# Altium schematic sheet LTC2949.SchDoc: LTC2949
size A4; Author: Andrea P; Organization: Waterloop; Address1: 200 University Ave W; Address2: Engineering 5, 1104; Address3: Waterloo, ON; Address4: N2L 3G1; Revision: B; SheetNumber: 2; SheetTotal: 4
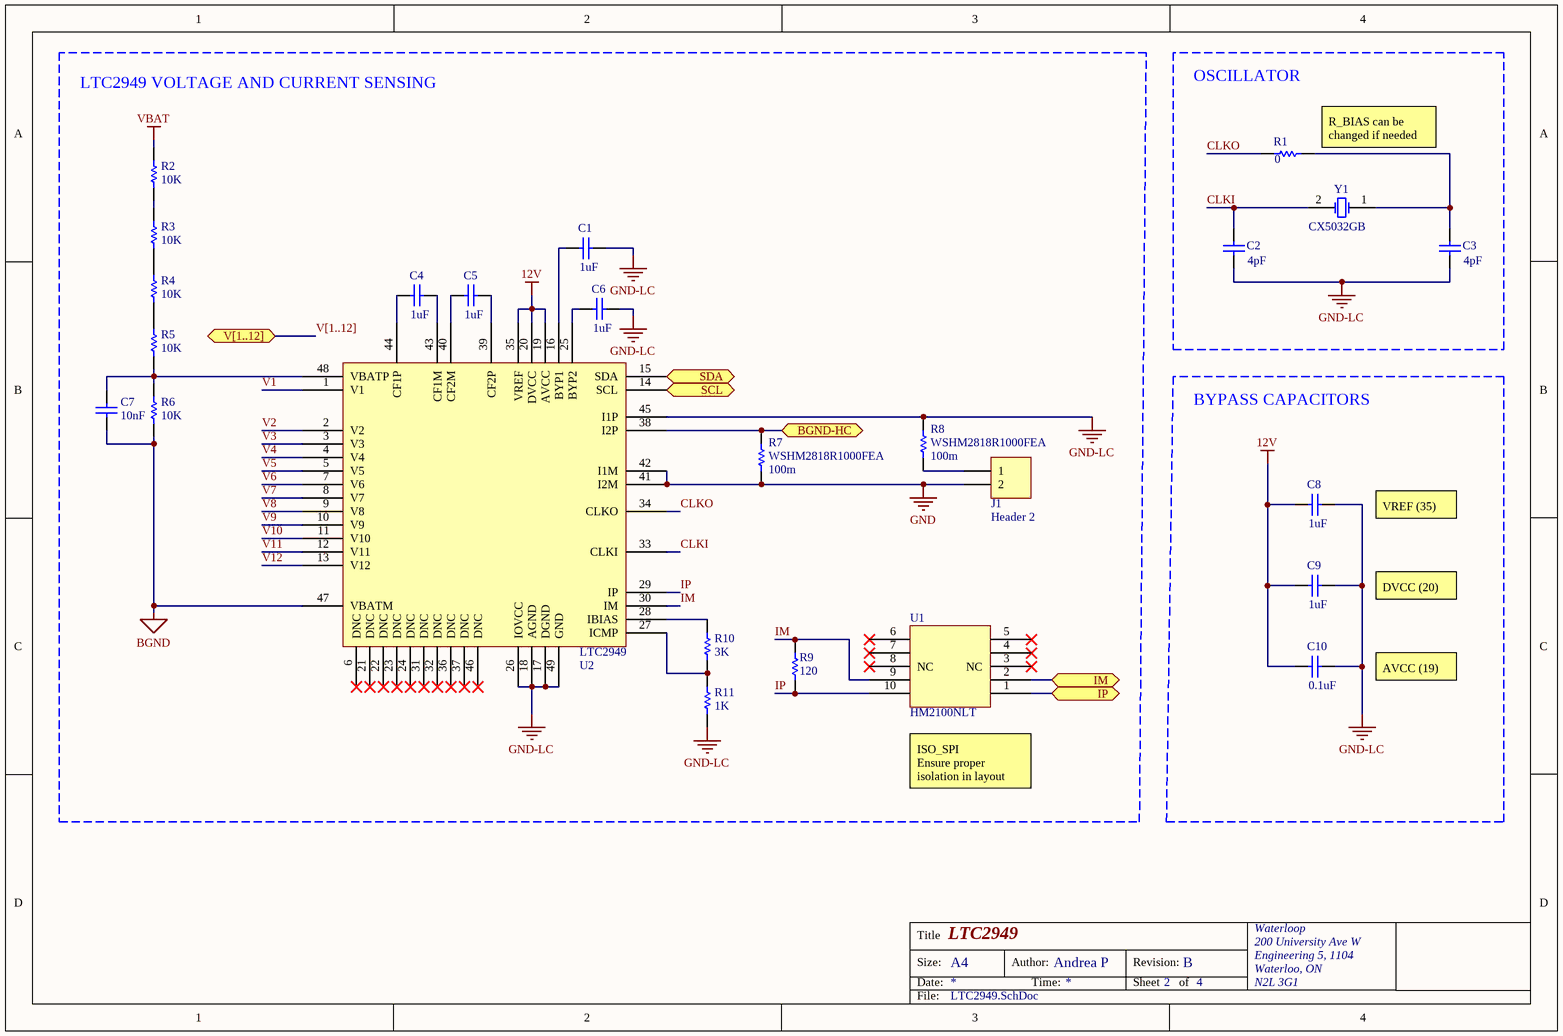
[diagram p0: LTC2949.SchDoc]

## Parts
C1  value 1uF  [C0805]  (hidden comment: Cap)
C2  value 4pF  [C0805]  (hidden comment: 50V)
C3  value 4pF  [C0805]  (hidden comment: 50V)
C4  value 1uF  [C0805]  (hidden comment: Cap)
C5  value 1uF  [C0805]  (hidden comment: Cap)
C6  value 1uF  [C0805]  (hidden comment: Cap)
C7  value 10nF  [C0805]  (hidden comment: Cap)
C8  value 1uF  [C0805]  (hidden comment: Cap)
C9  value 1uF  [C0805]  (hidden comment: Cap)
C10  value 0.1uF  [C0805]  (hidden comment: Cap)
J1  Header 2  [HDR1X2]
R1  value 0  [J1-0603]  (hidden comment: 0603)
R2  value 10K  [J1-0603]  (hidden comment: Res1)
R3  value 10K  [J1-0603]  (hidden comment: Res1)
R4  value 10K  [J1-0603]  (hidden comment: Res1)
R5  value 10K  [J1-0603]  (hidden comment: Res1)
R6  value 10K  [J1-0603]  (hidden comment: Res1)
R7  value 100m  Part Number: WSHM2818R1000FEA  [2818]  (hidden comment: Res1)
R8  value 100m  Part Number: WSHM2818R1000FEA  [2818]  (hidden comment: Res1)
R9  value 120  [J1-0603]  (hidden comment: 1%)
R10  value 3K  [J1-0603]  (hidden comment: 1%)
R11  value 1K  [J1-0603]  (hidden comment: 1%)
U1  HM2100NLT  [HM2100NLT]
U2  LTC2949  [LTC2949]
Y1  CX5032GB  [CX5032GB08000H0HPQZ1]

## Blocks framed on the sheet
LTC2949 VOLTAGE AND CURRENT SENSING: C1 C4-C7 J1 R2-R11 U1 U2
OSCILLATOR: C2 C3 R1 Y1
BYPASS CAPACITORS: C8-C10

## Ports
BGND-HC (bidir), IM (bidir), IP (bidir), SCL (bidir), SDA (bidir), V[1..12] (bidir)

## Nets
12V: C8.1 C9.1 C10.1 U2.19(AVCC) U2.20(DVCC) U2.35(VREF)
BGND: C7.1 R6.1 U2.47(VBATM)
GND: J1.2 R7.1 U2.41(I2M) U2.42(I1M)
GND-LC: C1.2 C2.1 C3.1 C6.2 C8.2 C9.2 C10.2 R8.2 R11.2 U2.17(DGND) U2.18(AGND) U2.26(IOVCC) U2.45(I1P) U2.49(GND)
VBAT: R2.2
BGND-HC: R7.2 U2.38(I2P) ; port BGND-HC
CLKI: C2.2 U2.33(CLKI) Y1.2(OSC2)
CLKO: R1.1 U2.34(CLKO)
IM: R9.2 U1.9 U2.30(IM)
IM: U1.2 ; port IM  [a separate net that carries the same name]
IP: R9.1 U1.10 U2.29(IP)
IP: U1.1 ; port IP  [a separate net that carries the same name]
SCL: U2.14(SCL) ; port SCL
SDA: U2.15(SDA) ; port SDA
V1: U2.1(V1)
V2: U2.2(V2)
V3: U2.3(V3)
V4: U2.4(V4)
V5: U2.5(V5)
V6: U2.7(V6)
V7: U2.8(V7)
V8: U2.9(V8)
V9: U2.10(V9)
V10: U2.11(V10)
V11: U2.12(V11)
V12: U2.13(V12)
NetC1_1: C1.1 U2.16(BYP1)
NetC3_2: C3.2 R1.2 Y1.1(OSC1)
NetC4_1: C4.1 U2.44(CF1P)
NetC4_2: C4.2 U2.43(CF1M)
NetC5_1: C5.1 U2.40(CF2M)
NetC5_2: C5.2 U2.39(CF2P)
NetC6_1: C6.1 U2.25(BYP2)
NetC7_2: C7.2 R5.1 R6.2 U2.48(VBATP)
NetJ1_1: J1.1 R8.1
NetR2_1: R2.1 R3.2
NetR3_1: R3.1 R4.2
NetR4_1: R4.1 R5.2
NetR10_1: R10.1 R11.1 U2.27(ICMP)
NetR10_2: R10.2 U2.28(IBIAS)

Not connected (* = marked no-connect by the designer): U1 3(NC)* 4* 5* 6* 7* 8(NC)*; U2 6(DNC)* 21(DNC)* 22(DNC)* 23(DNC)* 24(DNC)* 31(DNC)* 32(DNC)* 36(DNC)* 37(DNC)* 46(DNC)*

## Buses and harness runs
bus V[1..12] = port V[1..12]

## Notes on the sheet
- (near R1) R_BIAS can be changed if needed
- VREF (35)
- DVCC (20)
- AVCC (19)
- (near U1) ISO_SPI
  Ensure proper isolation in layout
- Title
- Size:
- Date:
- A4
- Author:
- Time:
- Revision:
- Sheet
- of
- File:

## Library data of the parts
C1 C4-C10 = Cap: Capacitor; Published: 8-Jun-2000; LatestRevisionDate: 17-Jul-2002; LatestRevisionNote: Re-released for DXP Platform.; PackageReference: RAD-0.3; Publisher: Altium Limited; PackageDescription: Radial Cap, Thru-Hole; 2 Leads; 0.3 in Pin Spacing
C2 = Cap: CBR08C409B5GAC. 4pF ±0.1pF 50V Ceramic Capacitor C0G, NP0 0805 (2012 Metric); Published: 8-Jun-2000; LatestRevisionDate: 17-Jul-2002; LatestRevisionNote: Re-released for DXP Platform.; PackageReference: RAD-0.3; Publisher: Altium Limited; PackageDescription: Radial Cap, Thru-Hole; 2 Leads; 0.3 in Pin Spacing
C3 = Cap: CBR08C409B5GAC; Published: 8-Jun-2000; LatestRevisionDate: 17-Jul-2002; LatestRevisionNote: Re-released for DXP Platform.; PackageReference: RAD-0.3; Publisher: Altium Limited; PackageDescription: Radial Cap, Thru-Hole; 2 Leads; 0.3 in Pin Spacing
J1 = Header 2: Header, 2-Pin; LatestRevisionDate: 17-Jul-2002; LatestRevisionNote: Re-released for DXP Platform.; Publisher: Altium Limited
R1 = Res1: ERJ-U030R00V. 0 Ohms Jumper 0.1W, 1/10W Chip Resistor 0603 (1608 Metric) Anti-Sulfur, Automotive AEC-Q200 Thick Film; Published: 8-Jun-2000; LatestRevisionDate: 17-Jul-2002; LatestRevisionNote: Re-released for DXP Platform.; PackageReference: AXIAL-0.3; Publisher: Altium Limited; PackageDescription: Axial Device, Thru-Hole; 2 Leads; 0.3 in Pin Spacing
R2-R11 = Res1: Resistor; Published: 8-Jun-2000; LatestRevisionDate: 17-Jul-2002; LatestRevisionNote: Re-released for DXP Platform.; PackageReference: AXIAL-0.3; Publisher: Altium Limited; PackageDescription: Axial Device, Thru-Hole; 2 Leads; 0.3 in Pin Spacing
Y1 = XTAL: 8MHz ±20ppm Crystal 12pF 300 Ohms 2-SMD, No Lead /; Published: 8-Jun-2000; LatestRevisionDate: 17-Jul-2002; LatestRevisionNote: Re-released for DXP Platform.; PackageReference: R38; Publisher: Altium Limited; PackageDescription: Crystal, Thru-Hole; 2 Leads; Body 3.1 x 8.2 mm (Dia.xH)